# Altium schematic sheet FPGA_FMC.SchDoc: SVPXFMC Carrier 3U
size 420 x 297 mm; CheckedBy: \; Author: G.Kasprowicz; CompanyName: ISE; DrawnBy: T.Przywozki; Organization: WUT ISE; Address1: Warsaw University of Technology; Address2: Nowowiejska 15/19 00-665 Warsaw; Revision: 1.0.; SheetNumber: 8; SheetTotal: 20; Project: SVPXFMC Carrier 3U; ModifiedBy: -; CheckedDate: -; Title2: FPGA FMC; DivGrp: ISE; Designer: G. Kasprowicz
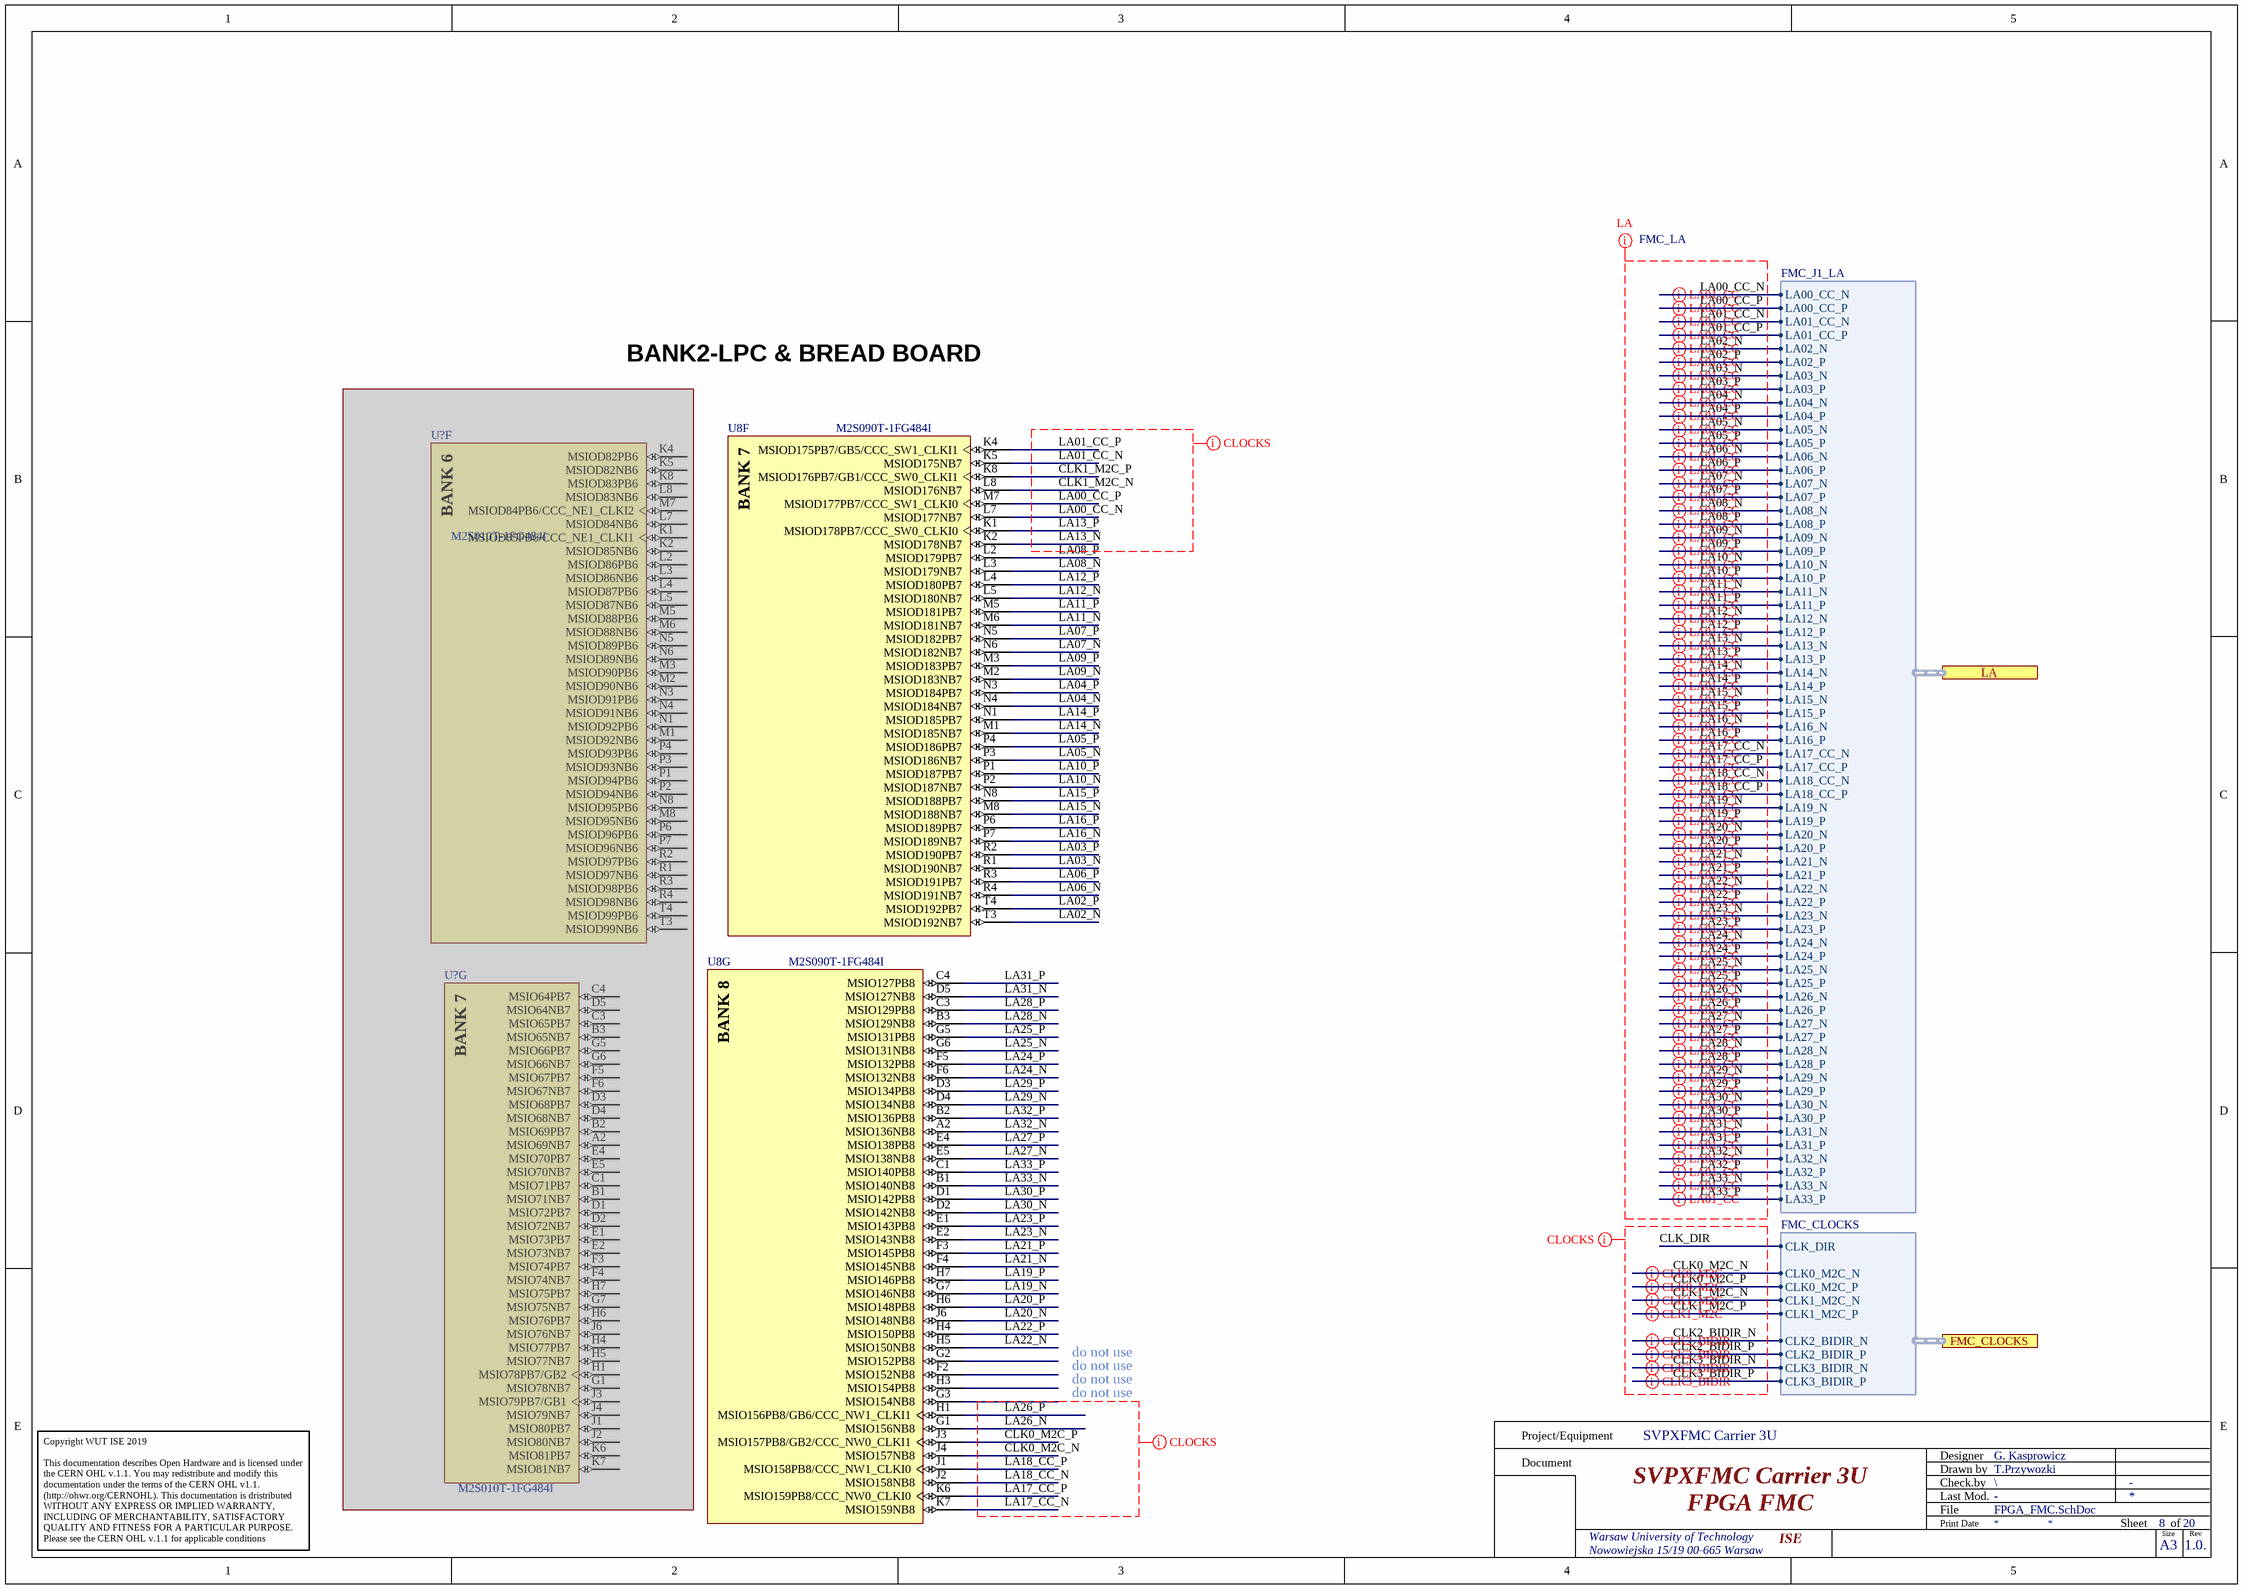
[diagram p0: FPGA_FMC.SchDoc]

## Parts
(Parts that share a designator on the sheet are numbered #1, #2 ... from top to bottom, then left to right.)
U8  M2S090T-1FG484I  [MCSM-FG-484_V]  (parts F,G of 15)
U?#1  M2S010T-1FG484I  [MCSM-FG-484_V]  (part F of 16)  (masked out: inside a compile mask, not in the netlist)
U?#2  M2S010T-1FG484I  [MCSM-FG-484_V]  (part G of 16)  (masked out: inside a compile mask, not in the netlist)

## Ports
FMC_CLOCKS (harness FMC_CLOCKS), LA (harness FMC_J1_LA)

## Harnesses
FMC_J1_LA: LA05_N, LA05_P, LA06_N, LA06_P, LA09_N, LA09_P, LA10_N, LA10_P, LA13_N, LA13_P, LA14_N, LA14_P, LA23_N, LA23_P, LA26_N, LA26_P, LA27_N, LA27_P, LA02_N, LA02_P, LA03_N, LA03_P, LA04_N, LA04_P, LA07_N, LA07_P, LA08_N, LA08_P, LA11_N, LA11_P, LA12_N, LA12_P, LA15_N, LA15_P, LA16_N, LA16_P, LA19_N, LA19_P, LA20_N, LA20_P, LA21_N, LA21_P, LA22_N, LA22_P, LA24_N, LA24_P, LA25_N, LA25_P, LA28_N, LA28_P, LA29_N, LA29_P, LA30_N, LA30_P, LA31_N, LA31_P, LA32_N, LA32_P, LA33_N, LA33_P, LA00_CC_N, LA00_CC_P, LA01_CC_N, LA01_CC_P, LA17_CC_N, LA17_CC_P, LA18_CC_N, LA18_CC_P
FMC_CLOCKS: CLK2_BIDIR_N, CLK2_BIDIR_P, CLK3_BIDIR_N, CLK3_BIDIR_P, CLK0_M2C_N, CLK0_M2C_P, CLK1_M2C_N, CLK1_M2C_P, CLK_DIR

## Nets
CLK0_M2C_N: U8.J4(MSIO157NB8) ; port FMC_CLOCKS.CLK0_M2C_N
CLK0_M2C_P: U8.J3(MSIO157PB8/GB2/CCC_NW0_CLKI1) ; port FMC_CLOCKS.CLK0_M2C_P
CLK1_M2C_N: U8.L8(MSIOD176NB7) ; port FMC_CLOCKS.CLK1_M2C_N
CLK1_M2C_P: U8.K8(MSIOD176PB7/GB1/CCC_SW0_CLKI1) ; port FMC_CLOCKS.CLK1_M2C_P
CLK2_BIDIR_N: port FMC_CLOCKS.CLK2_BIDIR_N
CLK2_BIDIR_P: port FMC_CLOCKS.CLK2_BIDIR_P
CLK3_BIDIR_N: port FMC_CLOCKS.CLK3_BIDIR_N
CLK3_BIDIR_P: port FMC_CLOCKS.CLK3_BIDIR_P
CLK_DIR: port FMC_CLOCKS.CLK_DIR
LA00_CC_N: U8.L7(MSIOD177NB7) ; port LA.LA00_CC_N
LA00_CC_P: U8.M7(MSIOD177PB7/CCC_SW1_CLKI0) ; port LA.LA00_CC_P
LA01_CC_N: U8.K5(MSIOD175NB7) ; port LA.LA01_CC_N
LA01_CC_P: U8.K4(MSIOD175PB7/GB5/CCC_SW1_CLKI1) ; port LA.LA01_CC_P
LA02_N: U8.T3(MSIOD192NB7) ; port LA.LA02_N
LA02_P: U8.T4(MSIOD192PB7) ; port LA.LA02_P
LA03_N: U8.R1(MSIOD190NB7) ; port LA.LA03_N
LA03_P: U8.R2(MSIOD190PB7) ; port LA.LA03_P
LA04_N: U8.N4(MSIOD184NB7) ; port LA.LA04_N
LA04_P: U8.N3(MSIOD184PB7) ; port LA.LA04_P
LA05_N: U8.P3(MSIOD186NB7) ; port LA.LA05_N
LA05_P: U8.P4(MSIOD186PB7) ; port LA.LA05_P
LA06_N: U8.R4(MSIOD191NB7) ; port LA.LA06_N
LA06_P: U8.R3(MSIOD191PB7) ; port LA.LA06_P
LA07_N: U8.N6(MSIOD182NB7) ; port LA.LA07_N
LA07_P: U8.N5(MSIOD182PB7) ; port LA.LA07_P
LA08_N: U8.L3(MSIOD179NB7) ; port LA.LA08_N
LA08_P: U8.L2(MSIOD179PB7) ; port LA.LA08_P
LA09_N: U8.M2(MSIOD183NB7) ; port LA.LA09_N
LA09_P: U8.M3(MSIOD183PB7) ; port LA.LA09_P
LA10_N: U8.P2(MSIOD187NB7) ; port LA.LA10_N
LA10_P: U8.P1(MSIOD187PB7) ; port LA.LA10_P
LA11_N: U8.M6(MSIOD181NB7) ; port LA.LA11_N
LA11_P: U8.M5(MSIOD181PB7) ; port LA.LA11_P
LA12_N: U8.L5(MSIOD180NB7) ; port LA.LA12_N
LA12_P: U8.L4(MSIOD180PB7) ; port LA.LA12_P
LA13_N: U8.K2(MSIOD178NB7) ; port LA.LA13_N
LA13_P: U8.K1(MSIOD178PB7/CCC_SW0_CLKI0) ; port LA.LA13_P
LA14_N: U8.M1(MSIOD185NB7) ; port LA.LA14_N
LA14_P: U8.N1(MSIOD185PB7) ; port LA.LA14_P
LA15_N: U8.M8(MSIOD188NB7) ; port LA.LA15_N
LA15_P: U8.N8(MSIOD188PB7) ; port LA.LA15_P
LA16_N: U8.P7(MSIOD189NB7) ; port LA.LA16_N
LA16_P: U8.P6(MSIOD189PB7) ; port LA.LA16_P
LA17_CC_N: U8.K7(MSIO159NB8) ; port LA.LA17_CC_N
LA17_CC_P: U8.K6(MSIO159PB8/CCC_NW0_CLKI0) ; port LA.LA17_CC_P
LA18_CC_N: U8.J2(MSIO158NB8) ; port LA.LA18_CC_N
LA18_CC_P: U8.J1(MSIO158PB8/CCC_NW1_CLKI0) ; port LA.LA18_CC_P
LA19_N: U8.G7(MSIO146NB8) ; port LA.LA19_N
LA19_P: U8.H7(MSIO146PB8) ; port LA.LA19_P
LA20_N: U8.J6(MSIO148NB8) ; port LA.LA20_N
LA20_P: U8.H6(MSIO148PB8) ; port LA.LA20_P
LA21_N: U8.F4(MSIO145NB8) ; port LA.LA21_N
LA21_P: U8.F3(MSIO145PB8) ; port LA.LA21_P
LA22_N: U8.H5(MSIO150NB8) ; port LA.LA22_N
LA22_P: U8.H4(MSIO150PB8) ; port LA.LA22_P
LA23_N: U8.E2(MSIO143NB8) ; port LA.LA23_N
LA23_P: U8.E1(MSIO143PB8) ; port LA.LA23_P
LA24_N: U8.F6(MSIO132NB8) ; port LA.LA24_N
LA24_P: U8.F5(MSIO132PB8) ; port LA.LA24_P
LA25_N: U8.G6(MSIO131NB8) ; port LA.LA25_N
LA25_P: U8.G5(MSIO131PB8) ; port LA.LA25_P
LA26_N: U8.G1(MSIO156NB8) ; port LA.LA26_N
LA26_P: U8.H1(MSIO156PB8/GB6/CCC_NW1_CLKI1) ; port LA.LA26_P
LA27_N: U8.E5(MSIO138NB8) ; port LA.LA27_N
LA27_P: U8.E4(MSIO138PB8) ; port LA.LA27_P
LA28_N: U8.B3(MSIO129NB8) ; port LA.LA28_N
LA28_P: U8.C3(MSIO129PB8) ; port LA.LA28_P
LA29_N: U8.D4(MSIO134NB8) ; port LA.LA29_N
LA29_P: U8.D3(MSIO134PB8) ; port LA.LA29_P
LA30_N: U8.D2(MSIO142NB8) ; port LA.LA30_N
LA30_P: U8.D1(MSIO142PB8) ; port LA.LA30_P
LA31_N: U8.D5(MSIO127NB8) ; port LA.LA31_N
LA31_P: U8.C4(MSIO127PB8) ; port LA.LA31_P
LA32_N: U8.A2(MSIO136NB8) ; port LA.LA32_N
LA32_P: U8.B2(MSIO136PB8) ; port LA.LA32_P
LA33_N: U8.B1(MSIO140NB8) ; port LA.LA33_N
LA33_P: U8.C1(MSIO140PB8) ; port LA.LA33_P

Not connected (* = marked no-connect by the designer): U8 F2(MSIO152NB8) G2(MSIO152PB8) G3(MSIO154NB8) H3(MSIO154PB8)

## Layout directives
differential pair; differential pair class Diff_100; differential pair class Diff_LA: LA00_CC_N, LA00_CC_P, LA01_CC_N, LA01_CC_P, LA02_N, LA02_P, LA03_N, LA03_P, LA04_N, LA04_P, LA05_N, LA05_P, LA06_N, LA06_P, LA07_N, LA07_P, LA08_N, LA08_P, LA09_N, LA09_P, LA10_N, LA10_P, LA11_N, LA11_P, LA12_N, LA12_P, LA13_N, LA13_P, LA14_N, LA14_P, LA15_N, LA15_P, LA16_N, LA16_P, LA17_CC_N, LA17_CC_P, LA18_CC_N, LA18_CC_P, LA19_N, LA19_P, LA20_N, LA20_P, LA21_N, LA21_P, LA22_N, LA22_P, LA23_N, LA23_P, LA24_N, LA24_P, LA25_N, LA25_P, LA26_N, LA26_P, LA27_N, LA27_P, LA28_N, LA28_P, LA29_N, LA29_P, LA30_N, LA30_P, LA31_N, LA31_P, LA32_N, LA32_P, LA33_N, LA33_P
differential pair: CLK0_M2C_N, CLK0_M2C_P, CLK1_M2C_N, CLK1_M2C_P, CLK2_BIDIR_N, CLK2_BIDIR_P, CLK3_BIDIR_N, CLK3_BIDIR_P
net class FMC_LA: LA00_CC_N, LA00_CC_P, LA01_CC_N, LA01_CC_P, LA02_N, LA02_P, LA03_N, LA03_P, LA04_N, LA04_P, LA05_N, LA05_P, LA06_N, LA06_P, LA07_N, LA07_P, LA08_N, LA08_P, LA09_N, LA09_P, LA10_N, LA10_P, LA11_N, LA11_P, LA12_N, LA12_P, LA13_N, LA13_P, LA14_N, LA14_P, LA15_N, LA15_P, LA16_N, LA16_P, LA17_CC_N, LA17_CC_P, LA18_CC_N, LA18_CC_P, LA19_N, LA19_P, LA20_N, LA20_P, LA21_N, LA21_P, LA22_N, LA22_P, LA23_N, LA23_P, LA24_N, LA24_P, LA25_N, LA25_P, LA26_N, LA26_P, LA27_N, LA27_P, LA28_N, LA28_P, LA29_N, LA29_P, LA30_N, LA30_P, LA31_N, LA31_P, LA32_N, LA32_P, LA33_N, LA33_P
net class FMC_CLKs: CLK0_M2C_N, CLK0_M2C_P, CLK1_M2C_N, CLK1_M2C_P, CLK2_BIDIR_N, CLK2_BIDIR_P, CLK3_BIDIR_N, CLK3_BIDIR_P, CLK_DIR, LA00_CC_N, LA00_CC_P, LA01_CC_N, LA01_CC_P, LA13_N, LA13_P, LA17_CC_N, LA17_CC_P, LA18_CC_N, LA18_CC_P, LA26_N, LA26_P

## Notes on the sheet
- BANK2-LPC & BREAD BOARD
- do not use
- Project/Equipment
- Document
- Designer
- Drawn by
- Check.by
- File
- Last Mod.
- Print Date
- Sheet
- Size
- A3
- of
- Rev
- Copyright WUT ISE 2019
  This documentation describes Open Hardware and is licensed under the CERN OHL v.1.1. You may redistribute and modify this documentation under the terms of the CERN OHL v1.1.
  (http://ohwr.org/CERNOHL). This documentation is dristributed WITHOUT ANY EXPRESS OR IMPLIED WARRANTY, INCLUDING OF MERCHANTABILITY, SATISFACTORY QUALITY AND FITNESS FOR A PARTICULAR PURPOSE. Please see the CERN OHL v.1.1 for applicable conditions
- (in symbol CMP-0959-00045-1, part F) BANK 7
- (in symbol CMP-0959-00045-1, part G) BANK 8
- (in symbol CMP-0959-00069-1, part F) BANK 6
- (in symbol CMP-0959-00069-1, part G) BANK 7

## Library data of the parts
U8 = CMP-0959-00045-1: SmartFusion2 SoC FPGA, ARM Cortex-M3, 90 K LUTs, 267 User I/O, Transceiver Available, Design Security, Speed Grade 1, -40 to 100 degC, 484-Ball BGA; Manufacturer: Microsemi; Total User I/O: 267; PLLs and CCCs: 6; LSRAM 18K Blocks: 109; eNVM (K Bytes): 512; DDR Controllers (Count x Width): 1x18; Math Blocks (18x18): 84; Maximum Logic Elements: 86,316; eSRAM (K Bytes): 64; MSIOD (2.5V): 40; SERDES Lanes: 4; MSIO (3.3V): 157; Total RAM (K bits): 2074; DDRIO (2.5V): 70; uSRAM1K Blocks: 112; eSRAM (K Bytes) Non SECDED: 80; ComponentLink3URL: http://www.microsemi.com/document-portal/doc_download/131095-package-mechanical-drawings; DatasheetVersion: Rev. 5; ComponentLink3Description: Package Specification; ComponentLink1Description: Manufacturer URL; PackageReference: FG-484; RoHS: FALSE; ComponentLink1URL: http://www.microsemi.com/; Code_JEDEC: MS-034; Mounting Technology: Surface Mount; PackageDescription: 484-Ball Fine Pitch Plastic Ball Grid Array (FBGA), Body 23 x 23 mm, Pitch 1 mm; PackageVersion: Rev. 48, 11/2013; ComponentLink2URL: http://www.microsemi.com/document-portal/doc_download/130717-smartfusion2-datasheet; PartNumber: M2S090T-1FG484I; ComponentLink2Description: Datasheet; PartId: 1
U?#1 U?#2 = CMP-0959-00069-1: SmartFusion2 SoC FPGA, ARM Cortex-M3, 10 K LUTs, 233 User I/O, Transceiver Available, Design Security, Speed Grade 1, -40 to 100 degC, 484-Ball BGA; Manufacturer: Microsemi; MSIO (3.3V): 123; DDRIO (2.5V): 70; eSRAM (K Bytes): 64; uSRAM1K Blocks: 22; SERDES Lanes: 4; DDR Controllers (Count x Width): 1x18; MSIOD (2.5V): 40; Maximum Logic Elements: 12,084; eNVM (K Bytes): 256; PLLs and CCCs: 2; LSRAM 18K Blocks: 21; eSRAM (K Bytes) Non SECDED: 80; Total RAM (K bits): 400; Total User I/O: 233; PackageVersion: Rev. 48, 11/2013; ComponentLink3URL: http://www.microsemi.com/document-portal/doc_download/131095-package-mechanical-drawings; ComponentLink1Description: Manufacturer URL; DatasheetVersion: Rev. 5; RoHS: FALSE; ComponentLink2Description: Datasheet; Code_JEDEC: MS-034; ComponentLink3Description: Package Specification; ComponentLink2URL: http://www.microsemi.com/document-portal/doc_download/130717-smartfusion2-datasheet; PartNumber: M2S010T-1FG484I; ComponentLink1URL: http://www.microsemi.com/; Math Blocks (18x18): 22; Mounting Technology: Surface Mount; PackageDescription: 484-Ball Fine Pitch Plastic Ball Grid Array (FBGA), Body 23 x 23 mm, Pitch 1 mm; PackageReference: FG-484